# EAGLE design SensorLaser (EAGLE 7.6.0)
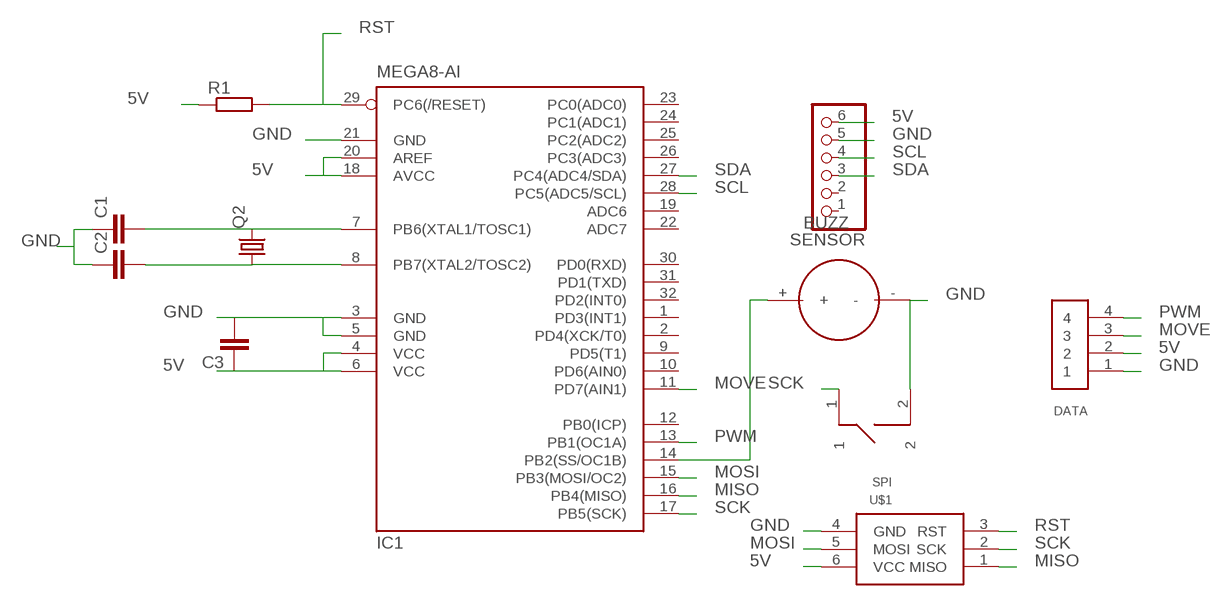
[diagram p0: schematic, sheet 1]

## Parts
BUZZ  KSQ-601BP  [KSQ-601BP]
C1  C-EUC0402K  [C0402K]
C2  C-EUC0402K  [C0402K]
C3  C-EUC0402K  [C0402K]
DATA  CP150_1X4  [CP150_1X4]
IC1  MEGA8-AI  [TQFP32-08]
Q2  CRYSTALHC49U70  [HC49U70]
R1  R-EU_M1206  [M1206]
SENSOR  PINHD-1X6  [1X06]
U$1  SPI  [HEAD-2X3]
U$2  PUSH_MEC  [PUSH_MECANICO]

## Nets
5V: C3.1 DATA.2 IC1.4(VCC) IC1.6(VCC) IC1.18(AVCC) IC1.20(AREF) R1.1 SENSOR.6 U$1.6(VCC)
GND: BUZZ.- C1.1 C2.1 C3.2 DATA.1 IC1.3(GND) IC1.5(GND) IC1.21(GND) SENSOR.5 U$1.4(GND) U$2.2
MISO: IC1.16(PB4(MISO)) U$1.1(MISO)
MOSI: IC1.15(PB3(MOSI/OC2)) U$1.5(MOSI)
MOVE: DATA.3 IC1.11(PD7(AIN1))
N$1: BUZZ.+ IC1.14(PB2(SS/OC1B))
N$6: C2.2 IC1.8(PB7(XTAL2/TOSC2)) Q2.1
N$7: C1.2 IC1.7(PB6(XTAL1/TOSC1)) Q2.2
PWM: DATA.4 IC1.13(PB1(OC1A))
RST: IC1.29(PC6(/RESET)) R1.2 U$1.3(RST)
SCK: IC1.17(PB5(SCK)) U$1.2(SCK) U$2.1
SCL: IC1.28(PC5(ADC5/SCL)) SENSOR.4
SDA: IC1.27(PC4(ADC4/SDA)) SENSOR.3
Unconnected: IC1.1(PD3(INT1)) IC1.2(PD4(XCK/T0)) IC1.9(PD5(T1)) IC1.10(PD6(AIN0)) IC1.12(PB0(ICP)) IC1.19(ADC6) IC1.22(ADC7) IC1.23(PC0(ADC0)) IC1.24(PC1(ADC1)) IC1.25(PC2(ADC2)) IC1.26(PC3(ADC3)) IC1.30(PD0(RXD)) IC1.31(PD1(TXD)) IC1.32(PD2(INT0)) SENSOR.1 SENSOR.2

## Library data of the parts
BUZZ = buzzer2:KSQ-601BP
C1-C3 = rcl:C-EU: CAPACITOR, European symbol
DATA = cp150:CP150_1X4
IC1 = atmel:MEGA8: MICROCONTROLLER 8 Kbytes FLASH, 1 kbytes SRAM, 512 bytes EEPROM, USART, 6-channel 10 bit ADC, 2-channel 8 bit ADC Pin compatible with Atmega48, ATMega88, ATMega168 Source: avr.lbr; MPN: ATMEGA8-16AU; OC_FARNELL: 9171371; OC_NEWARK: 73M8863
Q2 = crystal:CRYSTAL: CRYSTAL; OC_FARNELL: unknown; OC_NEWARK: unknown
R1 = rcl:R-EU_: RESISTOR, European symbol
SENSOR = pinhead:PINHD-1X6: PIN HEADER
U$1 = spi:SPI
U$2 = push:PUSH_MEC

## Board
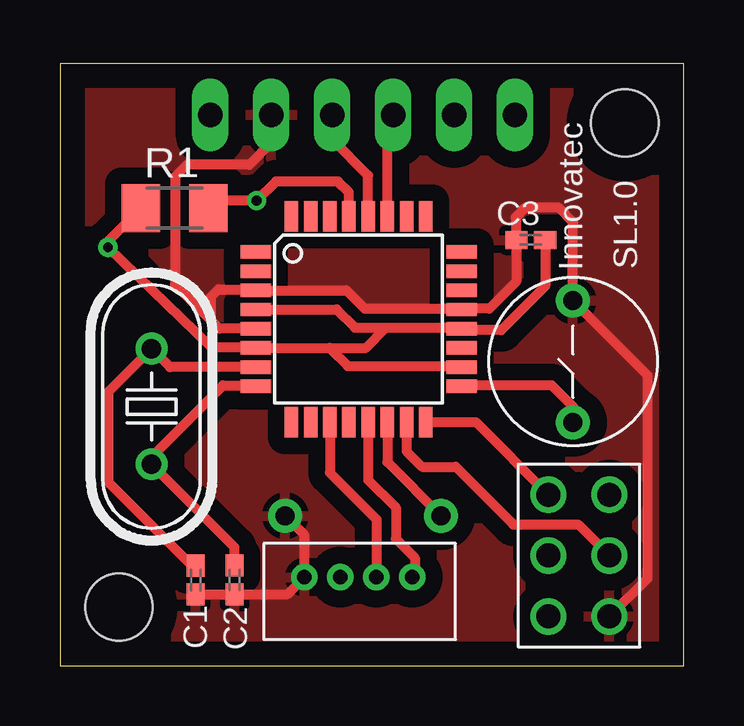
[diagram p1: board, top side]
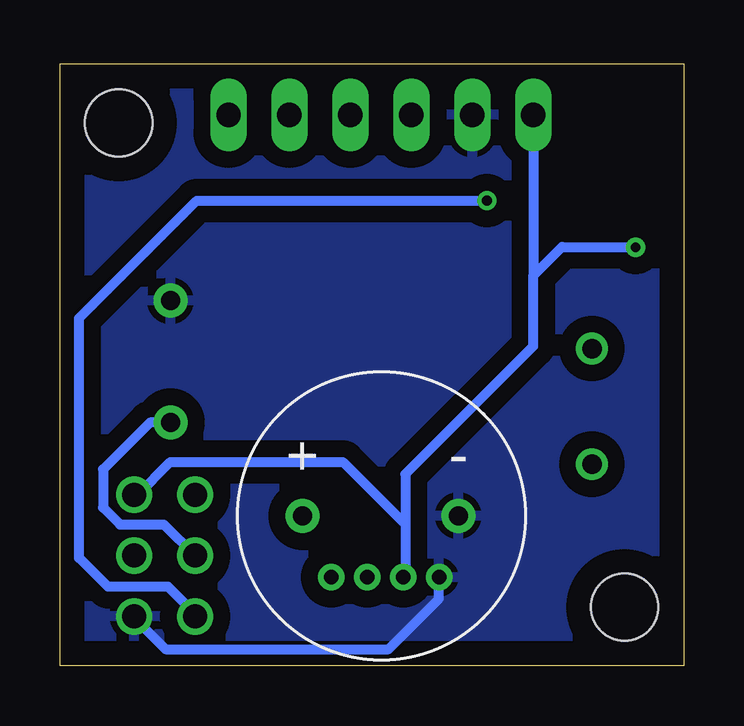
[diagram p2: board, bottom side, seen from below]

Size 26 x 25.1 mm. Coordinates in mm from the lower left corner, seen from the top.
Outline: 0,0 26,0 26,25.1 0,25.1 0,0
Copper layers (1*16): Top 0.035mm / dielectric 1.5mm / Bottom 0.035mm
Design rules "default": minimum track width 10mil, minimum drill 24mil, track to track 8mil, track to pad 8mil, pad to pad 8mil, via to via 8mil, smd to smd 8mil, copper to edge 40mil, drill to drill 8mil, minimum pad ring 10mil, minimum via ring 8mil, stop-mask expansion 4mil, vias tented up to drill 0mil, thermal gap 10mil
Holes 2.8 mm at 23.55,22.64 2.46,2.45

### Footprints (pad centres in the part's own frame; a part is rotated, then mirrored left to right if it is on the bottom)
KSQ-601BP = drill 0.8 pad 1.422: + -3.3,0; - 3.2,0
C0402K = smd 0.925 x 0.74: 1 -0.6,0; 2 0.6,0
CP150_1X4 = drill 0.6: 1 -2.2,0; 2 -0.7,0; 3 0.8,0; 4 2.3,0
TQFP32-08 = smd 1.27 x 0.559: 1 -4.293,2.8; 2 -4.293,2; 3 -4.293,1.2; 4 -4.293,0.4; 5 -4.293,-0.4; 6 -4.293,-1.2; 7 -4.293,-2; 8 -4.293,-2.8; 17 4.293,-2.8; 18 4.293,-2; 19 4.293,-1.2; 20 4.293,-0.4; 21 4.293,0.4; 22 4.293,1.2; 23 4.293,2; 24 4.293,2.8 | smd 0.559 x 1.27: 9 -2.8,-4.293; 10 -2,-4.293; 11 -1.2,-4.293; 12 -0.4,-4.293; 13 0.4,-4.293; 14 1.2,-4.293; 15 2,-4.293; 16 2.8,-4.293; 25 2.8,4.293; 26 2,4.293; 27 1.2,4.293; 28 0.4,4.293; 29 -0.4,4.293; 30 -1.2,4.293; 31 -2,4.293; 32 -2.8,4.293
HC49U70 = drill 0.813: 1 -2.413,0; 2 2.413,0
M1206 = smd 1.6 x 2: 1 -1.4,0; 2 1.4,0
1X06 = drill 1.016 long: 1 -6.35,0; 2 -3.81,0; 3 -1.27,0; 4 1.27,0; 5 3.81,0; 6 6.35,0
HEAD-2X3 = drill 1: 1 -2.54,-1.27; 2 0,-1.27; 3 2.54,-1.27; 4 2.54,1.27; 5 0,1.27; 6 -2.54,1.27
PUSH_MECANICO = drill 0.8 pad 1.422: 1 -2.54,0; 2 2.54,0

### Placement (x,y rotation side)
BUZZ  12.59,6.26 0 bottom
C1  5.66,3.58 90 top
C2  7.28,3.59 90 top
C3  19.63,17.76 180 top
DATA  12.39,3.7 0 top
IC1  12.45,14.46 0 top
Q2  3.82,10.82 90 top
R1  4.78,19.09 0 top
SENSOR  12.62,22.98 180 top
U$1  21.64,4.6 270 top
U$2  21.39,12.69 90 top

### Tracks (layer width: path | path; a pad name or v marks a point on that pad's centre or on a via)
5V  (via drill 0.4)
  Top 0.406: IC1.4 11.54,14.86 12.3,14.1 13.6,14.1 | 13.6,14.1 16.7,14.1 IC1.20 16.8,14 18.4,14 20.23,15.83 C3.1 | 11.24,13.26 IC1.6 8.12,13.3 6.3,13.3 v2,17.45 2,17.71 R1.1 3.4,19.07 | 11.24,13.26 12,12.5 16.7,12.5 IC1.18 | 11.24,13.26 12.76,13.26 13.6,14.1
  Bottom 0.406: SENSOR.6 6.27,16.27 | 11.6,5.9 11.6,8 6.27,13.33 6.27,16.27 | 11.6,5.9 11.6,3.79 DATA.2 | U$1.6 22.76,7.14 21.4,8.5 14.2,8.5 11.6,5.9 | 6.27,16.27 5.07,17.47 2.02,17.47 v2,17.45
GND
  Top 0.406: BUZZ.- 10.19,5.46 DATA.1 9.48,2.99 C2.1 C1.1 | IC1.5 6.64,14.06 6.3,14.4 | 6.3,14.4 6.3,15.4 6.6,15.7 8.12,15.7 IC1.3 11.94,15.66 12.7,14.9 16.7,14.9 IC1.21 16.78,14.9 17.9,14.9 19.03,16.03 C3.2 19,17.79 19,18.7 19.4,19.1 20.8,19.1 21.39,18.51 U$2.2 24.5,12.12 24.5,3.65 U$1.4 | SENSOR.5 8.81,21.81 7.9,20.9 5.3,20.9 4.8,20.4 4.8,15.9 6.3,14.4
  Bottom 0.406: U$1.4 22.91,2.01 21.6,0.7 12.3,0.7 10.2,2.8 DATA.1
  pour Bottom (isolate 0.7): -4.6,30 34,29.9 34.2,-2.7 -4.4,-2.6
  pour Top (isolate 0.7): -2,28.8 31.5,28.8 31,-1.8 -2.5,-1.8
MISO
  Top 0.406: IC1.16 17.34,10.17 U$1.1
MOSI
  Top 0.406: IC1.15 14.45,8.95 15.1,8.3 16.5,8.3 18.9,5.9 21.61,5.9 U$1.5
MOVE
  Top 0.406: IC1.11 11.25,8.05 13.2,6.1 DATA.3
N$1
  Top 0.406: IC1.14 13.65,8.5 BUZZ.+
N$6
  Top 0.406: IC1.8 8.12,11.7 6.8,11.7 3.82,8.72 Q2.1 7.28,4.95 C2.2
N$7
  Top 0.406: IC1.7 4.59,12.46 Q2.2 2.04,11.45 2.04,7.65 5.51,4.18 C1.2
PWM
  Top 0.406: IC1.13 12.85,7.75 14,6.6 14,5.3 14.8,4.5 14.8,3.81 DATA.4
RST  (via drill 0.4)
  Top 0.406: R1.2 6.49,19.4 v8.2,19.4 9,20.2 11.6,20.2 12.05,19.75 IC1.29
  Bottom 0.406: U$1.3 20.37,2.17 21.5,3.3 24,3.3 25.2,4.5 25.2,14.5 20.3,19.4 v8.2,19.4
SCK
  Top 0.406: U$2.1 21.39,10.81 20.5,11.7 16.78,11.7 IC1.17
  Bottom 0.406: U$2.1 22.25,10.15 24.2,8.2 24.2,6.6 23.5,5.9 21.67,5.9 U$1.2
SCL
  Top 0.406: IC1.28 12.85,20.45 11.4,21.9 11.4,22.93 SENSOR.4
SDA
  Top 0.406: IC1.27 13.65,22.74 SENSOR.3

### Text on the board
tPlace: SL1.0 | Innovatec